# Altium schematic sheet [17] - HDMI_IN.SchDoc
size A2
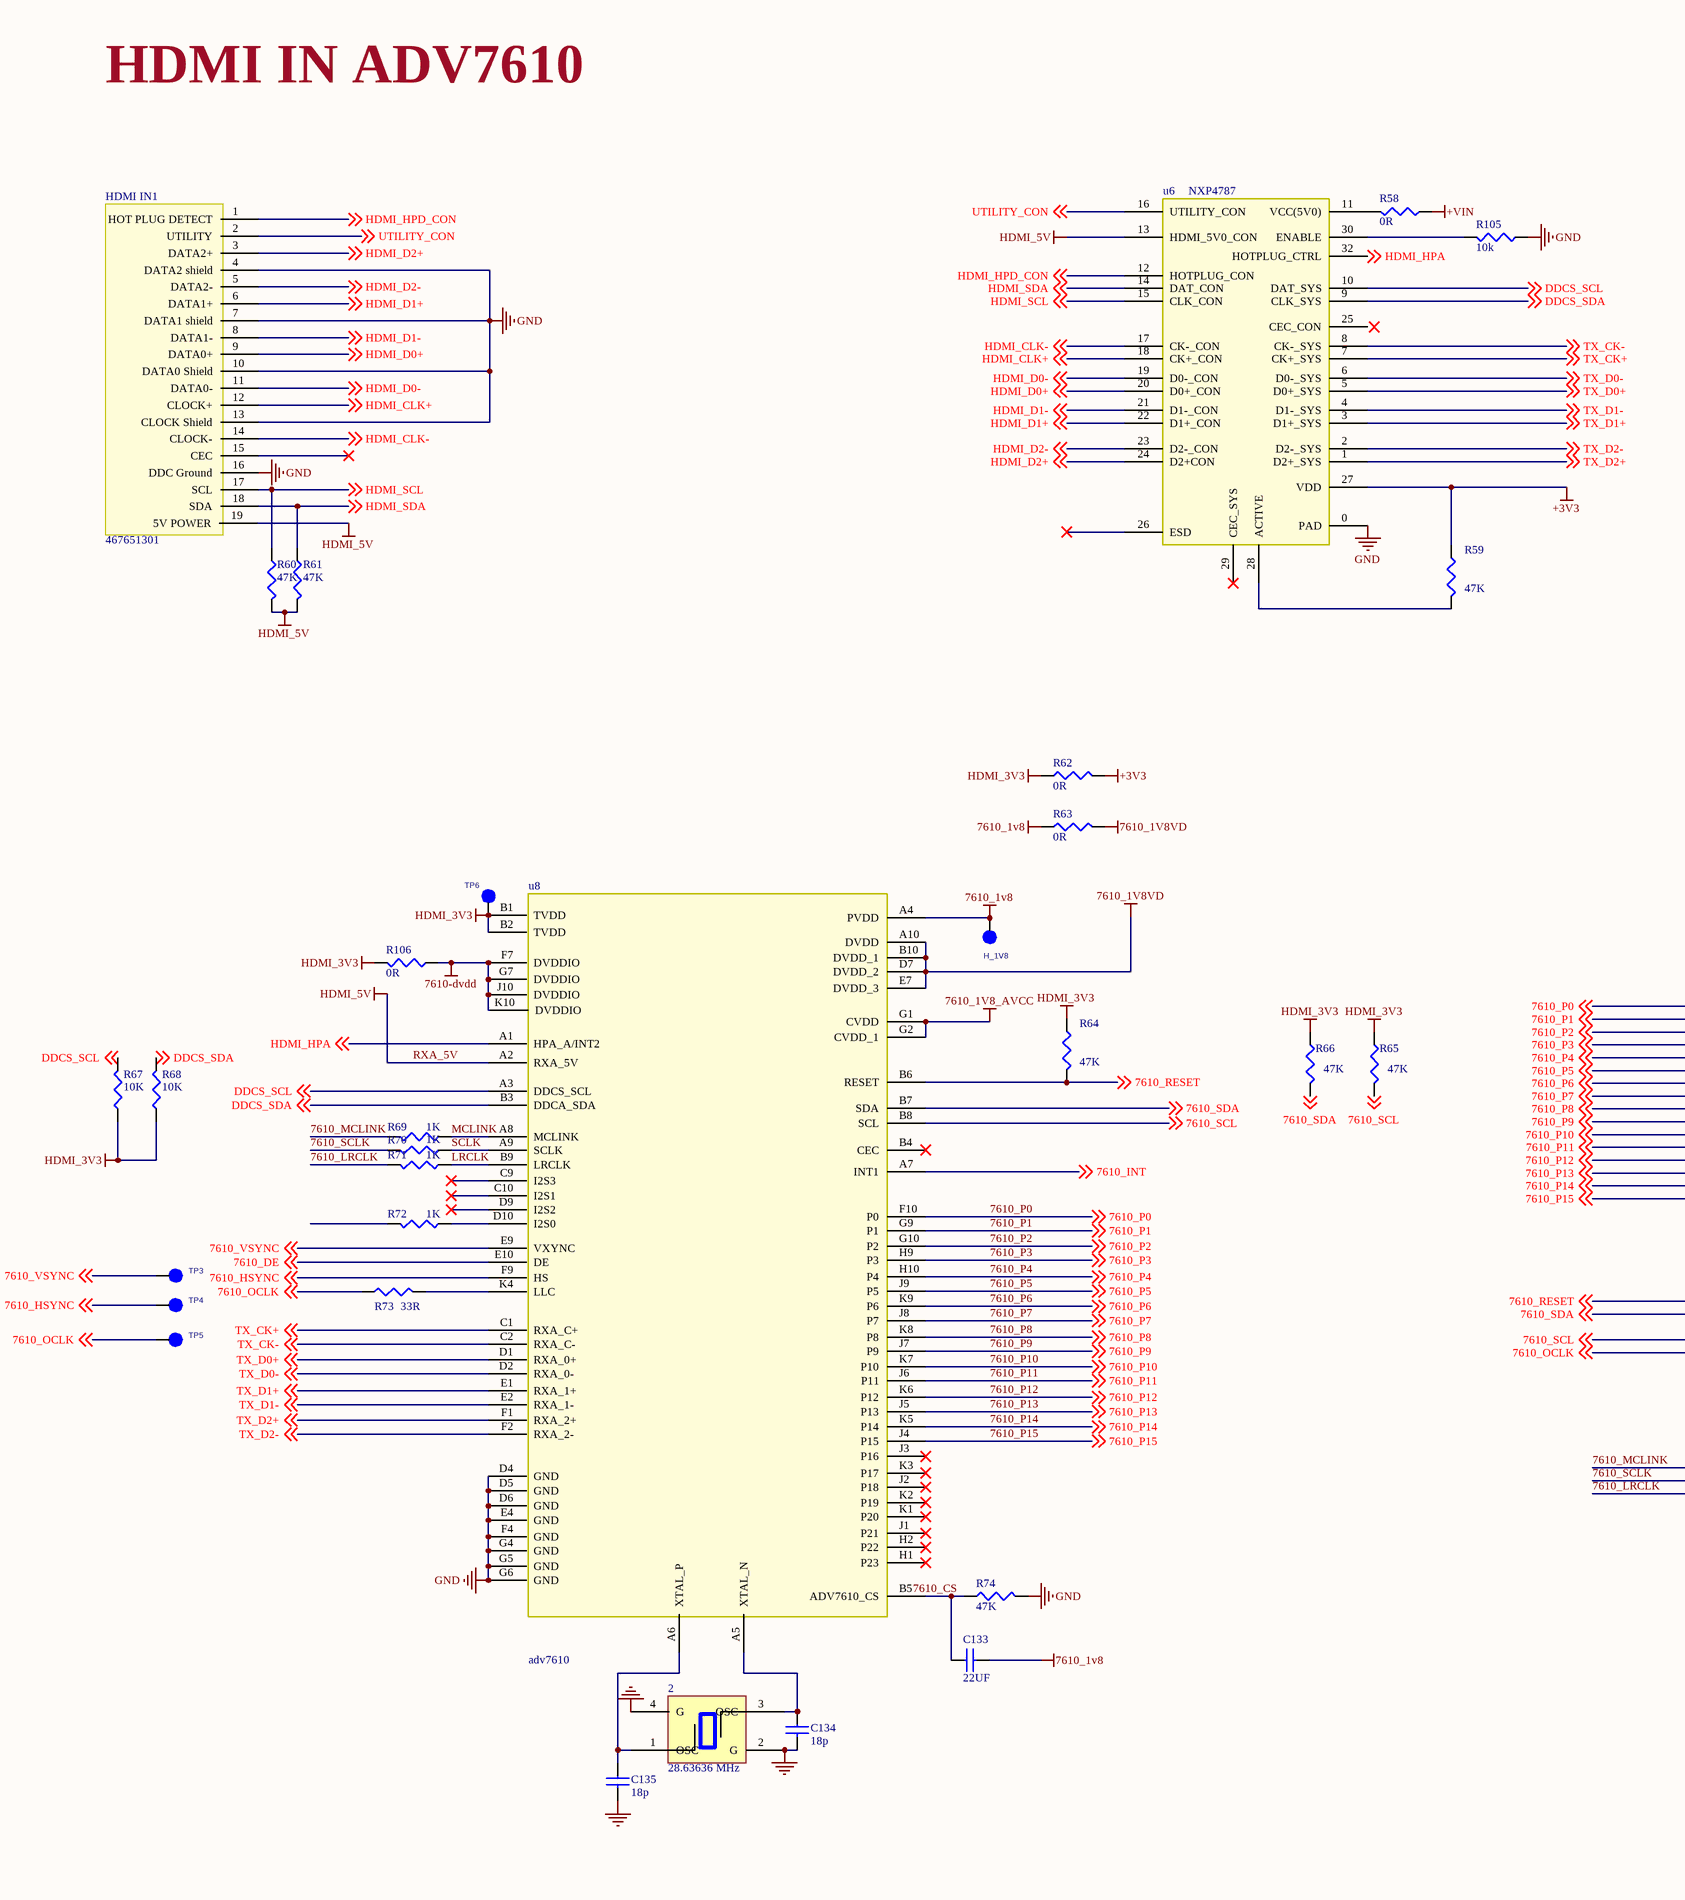
[diagram p0: [17] - HDMI_IN.SchDoc, left]
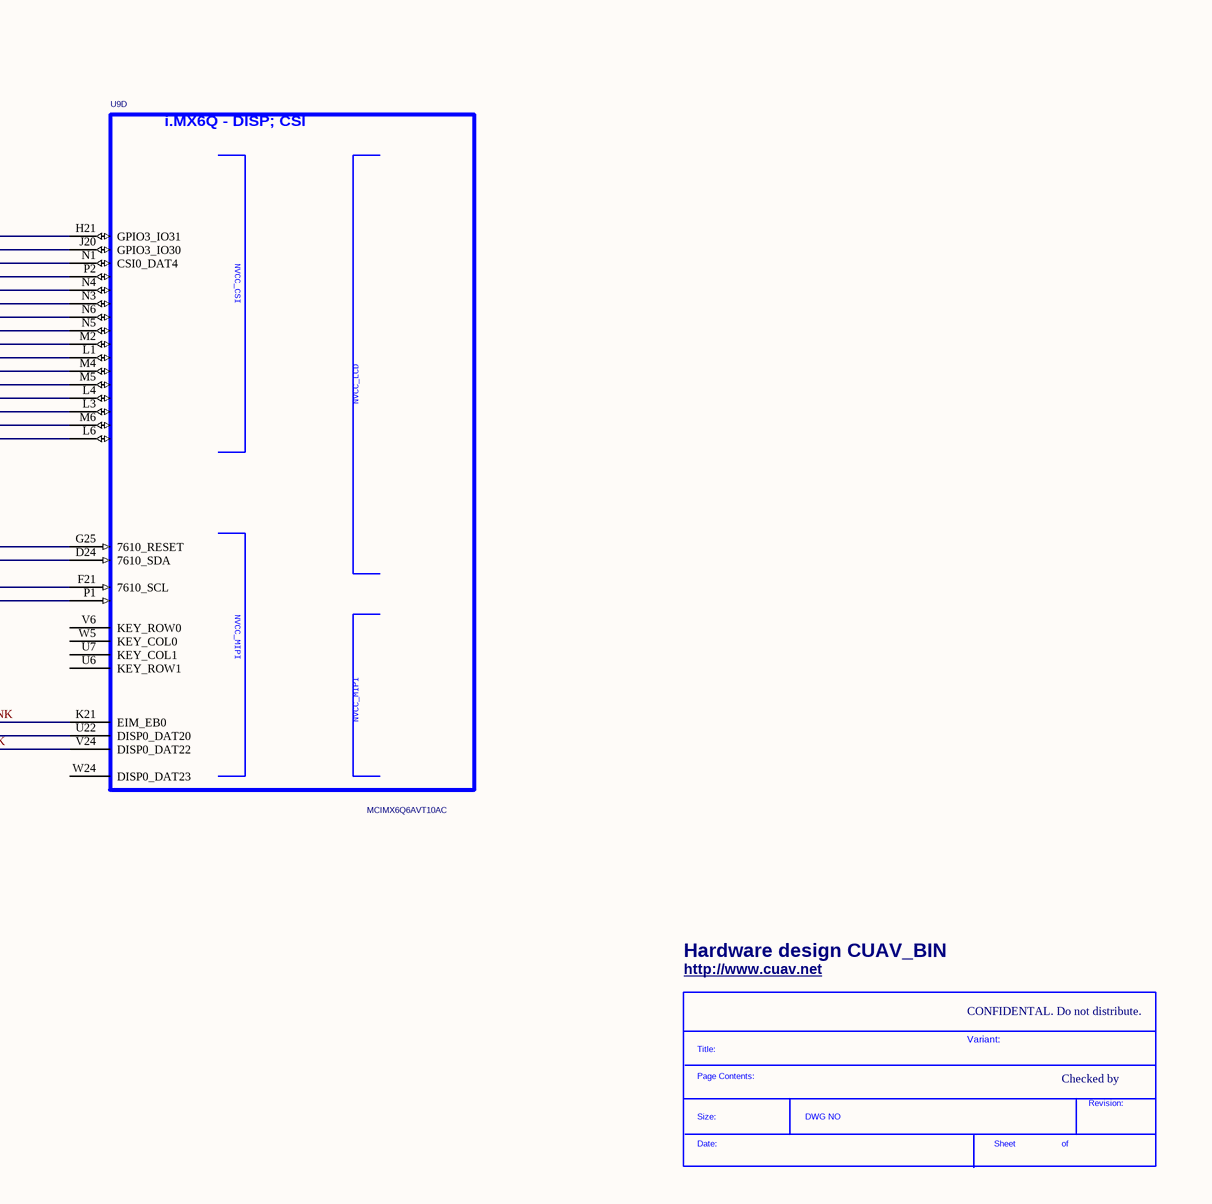
[diagram p1: [17] - HDMI_IN.SchDoc, right]

## Parts
2  28.63636 MHz  [TSX-3225]
*  SDTitleBlock  (value not drawn)  (graphical)
C133  22UF  [0603C]
C134  18p  [0402cap]
C135  18p  [0402cap]
H_1V8  H_3V3  [C035S]  (value not drawn)
HDMI_IN1  467651301  [467651301]
R58  0R  [R0402]
R59  47K  [R0402]
R60  47K  [R0402]
R61  47K  [R0402]
R62  0R  [R0402]
R63  0R  [R0402]
R64  47K  [R0402]
R65  47K  [R0402]
R66  47K  [R0402]
R67  10K  [R0402]
R68  10K  [R0402]
R69  1K  [R0402]
R70  1K  [R0402]
R71  1K  [R0402]
R72  1K  [R0402]
R73  33R  [R0402]
R74  47K  [R0402]
R105  10k  [R0402]
R106  0R  [R0402]
TP3  7610_VSYNC  [C035S]  (value not drawn)
TP4  7610_HSYNC  [C035S]  (value not drawn)
TP5  tpad_020  [C035S]  (value not drawn)
TP6  H_3V3  [C035S]  (value not drawn)
u6  NXP4787  [QFN32_1]
u8  adv7610  [BC-76]
U9  MCIMX6Q6AVT10AC  (part D of 12)

## Nets
7610-dvdd: R106.1 u8.F7(DVDDIO) u8.G7(DVDDIO) u8.J10(DVDDIO) u8.K10(DVDDIO)
7610_1v8: C133.2 H_1V8.1(Pin1) R63.1 u8.A4(PVDD)
7610_1V8_AVCC: u8.G1(CVDD) u8.G2(CVDD_1)
7610_1V8VD: R63.2 u8.A10(DVDD) u8.B10(DVDD_1) u8.D7(DVDD_2) u8.E7(DVDD_3)
+3V3: R59.1 R62.2 u6.27(VDD)
+VIN: R58.1
GND: 2.2(G) 2.4(G) C134.2 C135.2 HDMI_IN1.4(DATA2_shield) HDMI_IN1.7(DATA1_shield) HDMI_IN1.10(DATA0_Shield) HDMI_IN1.13(CLOCK_Shield) HDMI_IN1.16(DDC_Ground) R74.2 R105.1 u6.0(PAD) u8.D4(GND) u8.D5(GND) u8.D6(GND) u8.E4(GND) u8.F4(GND) u8.G4(GND) u8.G5(GND) u8.G6(GND)
HDMI_3V3: R62.1 R64.1 R65.1 R66.1 R67.1 R68.1 R106.2 TP6.1(Pin1) u8.B1(TVDD) u8.B2(TVDD)
RXA_5V: HDMI_IN1.19(5V_POWER) R60.2 R61.2 u6.13(HDMI_5V0_CON) u8.A2(RXA_5V)  [also labelled HDMI_5V]
7610_DE: u8.E10(DE) ; off-sheet 7610_DE
7610_HSYNC: TP4.1(Pin1) u8.F9(HS) ; off-sheet 7610_HSYNC
7610_INT: u8.A7(INT1) ; off-sheet 7610_INT
7610_LRCLK: R71.2 U9.V24(DISP0_DAT22)
7610_MCLINK: R69.2 U9.K21(EIM_EB0)
7610_OCLK: R73.1 TP5.1(Pin1) U9.P1 ; off-sheet 7610_OCLK
7610_P0: u8.F10(P0) U9.H21(GPIO3_IO31) ; off-sheet 7610_P0
7610_P1: u8.G9(P1) U9.J20(GPIO3_IO30) ; off-sheet 7610_P1
7610_P2: u8.G10(P2) U9.N1(CSI0_DAT4) ; off-sheet 7610_P2
7610_P3: u8.H9(P3) U9.P2 ; off-sheet 7610_P3
7610_P4: u8.H10(P4) U9.N4 ; off-sheet 7610_P4
7610_P5: u8.J9(P5) U9.N3 ; off-sheet 7610_P5
7610_P6: u8.K9(P6) U9.N6 ; off-sheet 7610_P6
7610_P7: u8.J8(P7) U9.N5 ; off-sheet 7610_P7
7610_P8: u8.K8(P8) U9.M2 ; off-sheet 7610_P8
7610_P9: u8.J7(P9) U9.L1 ; off-sheet 7610_P9
7610_P10: u8.K7(P10) U9.M4 ; off-sheet 7610_P10
7610_P11: u8.J6(P11) U9.M5 ; off-sheet 7610_P11
7610_P12: u8.K6(P12) U9.L4 ; off-sheet 7610_P12
7610_P13: u8.J5(P13) U9.L3 ; off-sheet 7610_P13
7610_P14: u8.K5(P14) U9.M6 ; off-sheet 7610_P14
7610_P15: u8.J4(P15) U9.L6 ; off-sheet 7610_P15
7610_RESET: R64.2 u8.B6(RESET) U9.G25(7610_RESET) ; off-sheet 7610_RESET
7610_SCL: R65.2 u8.B8(SCL) U9.F21(7610_SCL) ; off-sheet 7610_SCL
7610_SCLK: R70.2 U9.U22(DISP0_DAT20)
7610_SDA: R66.2 u8.B7(SDA) U9.D24(7610_SDA) ; off-sheet 7610_SDA
7610_VSYNC: TP3.1(Pin1) u8.E9(VXYNC) ; off-sheet 7610_VSYNC
DDCS_SCL: R67.2 u6.10(DAT_SYS) u8.A3(DDCS_SCL) ; off-sheet DDCS_SCL
DDCS_SDA: R68.2 u6.9(CLK_SYS) u8.B3(DDCA_SDA) ; off-sheet DDCS_SDA
HDMI_CLK+: HDMI_IN1.12(CLOCK+) u6.18(CK+_CON) ; off-sheet HDMI_CLK+
HDMI_CLK-: HDMI_IN1.14(CLOCK-) u6.17(CK-_CON) ; off-sheet HDMI_CLK-
HDMI_D0+: HDMI_IN1.9(DATA0+) u6.20(D0+_CON) ; off-sheet HDMI_D0+
HDMI_D0-: HDMI_IN1.11(DATA0-) u6.19(D0-_CON) ; off-sheet HDMI_D0-
HDMI_D1+: HDMI_IN1.6(DATA1+) u6.22(D1+_CON) ; off-sheet HDMI_D1+
HDMI_D1-: HDMI_IN1.8(DATA1-) u6.21(D1-_CON) ; off-sheet HDMI_D1-
HDMI_D2+: HDMI_IN1.3(DATA2+) u6.24(D2+CON) ; off-sheet HDMI_D2+
HDMI_D2-: HDMI_IN1.5(DATA2-) u6.23(D2-_CON) ; off-sheet HDMI_D2-
HDMI_HPA: u6.32(HOTPLUG_CTRL) u8.A1(HPA_A/INT2) ; off-sheet HDMI_HPA
HDMI_HPD_CON: HDMI_IN1.1(HOT_PLUG_DETECT) u6.12(HOTPLUG_CON) ; off-sheet HDMI_HPD_CON
HDMI_SCL: HDMI_IN1.17(SCL) R60.1 u6.15(CLK_CON) ; off-sheet HDMI_SCL
HDMI_SDA: HDMI_IN1.18(SDA) R61.1 u6.14(DAT_CON) ; off-sheet HDMI_SDA
LRCLK: R71.1 u8.B9(LRCLK)
MCLINK: R69.1 u8.A8(MCLINK)
SCLK: R70.1 u8.A9(SCLK)
TX_CK+: u6.7(CK+_SYS) u8.C1(RXA_C+) ; off-sheet TX_CK+
TX_CK-: u6.8(CK-_SYS) u8.C2(RXA_C-) ; off-sheet TX_CK-
TX_D0+: u6.5(D0+_SYS) u8.D1(RXA_0+) ; off-sheet TX_D0+
TX_D0-: u6.6(D0-_SYS) u8.D2(RXA_0-) ; off-sheet TX_D0-
TX_D1+: u6.3(D1+_SYS) u8.E1(RXA_1+) ; off-sheet TX_D1+
TX_D1-: u6.4(D1-_SYS) u8.E2(RXA_1-) ; off-sheet TX_D1-
TX_D2+: u6.1(D2+_SYS) u8.F1(RXA_2+) ; off-sheet TX_D2+
TX_D2-: u6.2(D2-_SYS) u8.F2(RXA_2-) ; off-sheet TX_D2-
UTILITY_CON: HDMI_IN1.2(UTILITY) u6.16(UTILITY_CON) ; off-sheet UTILITY_CON
Net2_1: 2.1(OSC) C135.1 u8.A6(XTAL_P)
Net2_3: 2.3(OSC) C134.1 u8.A5(XTAL_N)
NetC133_1: C133.1 R74.1 u8.B5(ADV7610_CS)
NetR58_2: R58.2 u6.11(VCC(5V0))
NetR59_2: R59.2 u6.28(ACTIVE)
NetR72_1: R72.1 u8.D10(I2S0)
NetR73_2: R73.2 u8.K4(LLC)
NetR105_2: R105.2 u6.30(ENABLE)

Not connected (* = marked no-connect by the designer): HDMI_IN1 15(CEC)*; R72 2; u6 25(CEC_CON) 26(ESD)* 29(CEC_SYS)*; u8 B4(CEC)* C9(I2S3)* C10(I2S1)* D9(I2S2)* H1(P23)* H2(P22)* J1(P21)* J2(P18)* J3(P16)* K1(P20)* K2(P19)* K3(P17)*; U9 U6(KEY_ROW1) U7(KEY_COL1) V6(KEY_ROW0) W5(KEY_COL0) W24(DISP0_DAT23)

## Notes on the sheet
- HDMI IN ADV7610
- (near *) Hardware design CUAV_BIN
- (near *) http://www.cuav.net
- CONFIDENTAL. Do not distribute.
- Variant:
- Checked by
- Labels drawn without touching a wire or pin: 7610_CS
- (in symbol PCIMX6Q6VV1A, part D) i.MX6Q - DISP; CSI
- (in symbol SDTitleBlock) Title:; Page Contents:; Revision:; Size:; DWG NO; Date:; Sheet; of

## Library data of the parts
2 = TSX-3225
C133-C135 = C1005C0G1H180J: CAP CER 18PF 50V C0G 5% 0402; Manufacturer: TDK Corporation; .Checked PCB: used; Tolerance: ?%; Temperature Coefficient: C0G, NP0; Capacitance: 18pF; Category: Capacitors; Supplier Part Number: 445-1238-1-ND; Manufacturer Part Number: C1005C0G1H180J; Operating Temperature: -55癈 ~ 125癈; Package / Case: 0402 (1005 Metric); Price 1k [$]: 0.00468; Value: 18pF; .Checked SCH: used; Voltage - Rated: 50V; Supplier: Digikey; Supplier 1: Digi-Key; Supplier Part Number 1: 445-1238-1-ND; RoHS: RoHS Compliant; Stock 1: 24321; Pricing 1: 1=0.08, 10=0.05, 100=0.018, 250=0.013, 500=0.0096, 1000=0.0065 (USD); Mounting Type: Surface Mount, MLCC; Applications: General Purpose; Ratings: -; Size / Dimension: 0.039" L x 0.020" W (1.00mm x 0.50mm); Height - Seated (Max): -; Thickness (Max): 0.022" (0.55mm); Lead Spacing: -; Features: -; Packaging: Cut Tape (CT); Lead Style: -; ComponentLink1URL: http://www.tdk.co.jp/tefe02/e412_c.pdf; ComponentLink1Description: http://www.tdk.co.jp/tefe02/e412_c.pdf
H_1V8 TP3-TP6 = TESTLOOP: TEST POINT PAD 0.5MM DIA SMT, NO PART TO ORDER; CLASS: IO; AGILE_PN: 211-77484; ASSY_OPT: DNP; CAD_APPROVED: Yes; ROHS: Yes; HEIGHT: 0.1MM
R58-R64 R67-R74 R105 R106 = RC0402FR-071RL: RES 1.00 OHM 1/16W 1% 0402 SM; Manufacturer: Yageo; Resistance (Ohms): 1; Power (Watts): 0.063W, 1/16W; Tolerance: ?%; Value: 1R; .Checked PCB: used; Temperature Coefficient: ?00ppm/癈; Category: Resistors; Manufacturer Part Number: RC0402FR-071RL; Package / Case: 0402 (1005 Metric); Price 1k [$]: 0.01421; .Checked SCH: used; Supplier Part Number: 311-1.00LRCT-ND; Supplier: Digikey; Supplier 1: Digi-Key; Supplier Part Number 1: 311-1.00LRCT-ND; RoHS: RoHS Compliant; Stock 1: 347765; Pricing 1: 10=0.019, 50=0.0142, 100=0.0109, 250=0.00808, 500=0.00596, 1000=0.00397 (USD); Composition: Thick Film; Features: -; Size / Dimension: 0.039" L x 0.020" W (1.00mm x 0.50mm); Height: 0.016" (0.40mm); Number of Terminations: 2; Packaging: Cut Tape (CT); ComponentLink1URL: http://www.yageo.com/documents/recent/PYu-RC0402_51_RoHS_L_6.pdf; ComponentLink1Description: http://www.yageo.com/documents/recent/PYu-RC0402_51_RoHS_L_6.pdf
R65 R66 = RC0402FR-0739KL: RES 39.0K OHM 1/16W 1% 0402 SMD; Manufacturer: Yageo; Resistance (Ohms): 39K; Power (Watts): 0.063W, 1/16W; Tolerance: ?%; Value: 39k; .Checked PCB: used; Temperature Coefficient: ?00ppm/癈; Category: Resistors; Manufacturer Part Number: RC0402FR-0739KL; Package / Case: 0402 (1005 Metric); Price 1k [$]: 0.01421; .Checked SCH: used; Supplier Part Number: 311-39.0KLRCT-ND; Supplier: Digikey; Supplier 1: Digi-Key; Supplier Part Number 1: 311-39.0KLRCT-ND; RoHS: RoHS Compliant; Stock 1: 36775; Pricing 1: 10=0.014, 50=0.0104, 100=0.0079, 250=0.00584, 500=0.00432, 1000=0.00288 (USD); Composition: Thick Film; Features: -; Size / Dimension: 0.039" L x 0.020" W (1.00mm x 0.50mm); Height: 0.016" (0.40mm); Number of Terminations: 2; Packaging: Cut Tape (CT); ComponentLink1URL: http://www.yageo.com/documents/recent/PYu-RC0402_51_RoHS_L_6.pdf; ComponentLink1Description: http://www.yageo.com/documents/recent/PYu-RC0402_51_RoHS_L_6.pdf
U9 = PCIMX6Q6VV1A: IC MCU MX6QUAD ARM CORTEX-A9 FCPBGA624; CAD_APPROVED: Yes; MFG_NAME01: FREESCALE SEMICONDUCTOR; AGILE_PN: 344-01218; CLASS: IC; HEIGHT: 2.16MM; ROHS: Yes; MFG_PN01: MCIMX6Q6AVT10AC